# EasyEDA Pro project ProProject_powerboard_ssl_philipp_2023-09-25.epro, schematic Schematic3
Create Date: 2023-04-07; Page Name: P1; Project Name: powerboard_ssl_philipp; Schematic Name: Schematic3; Update Date: 2023-04-07; Company: 嘉立创EDA; Page Size: A4; Version: V1.0
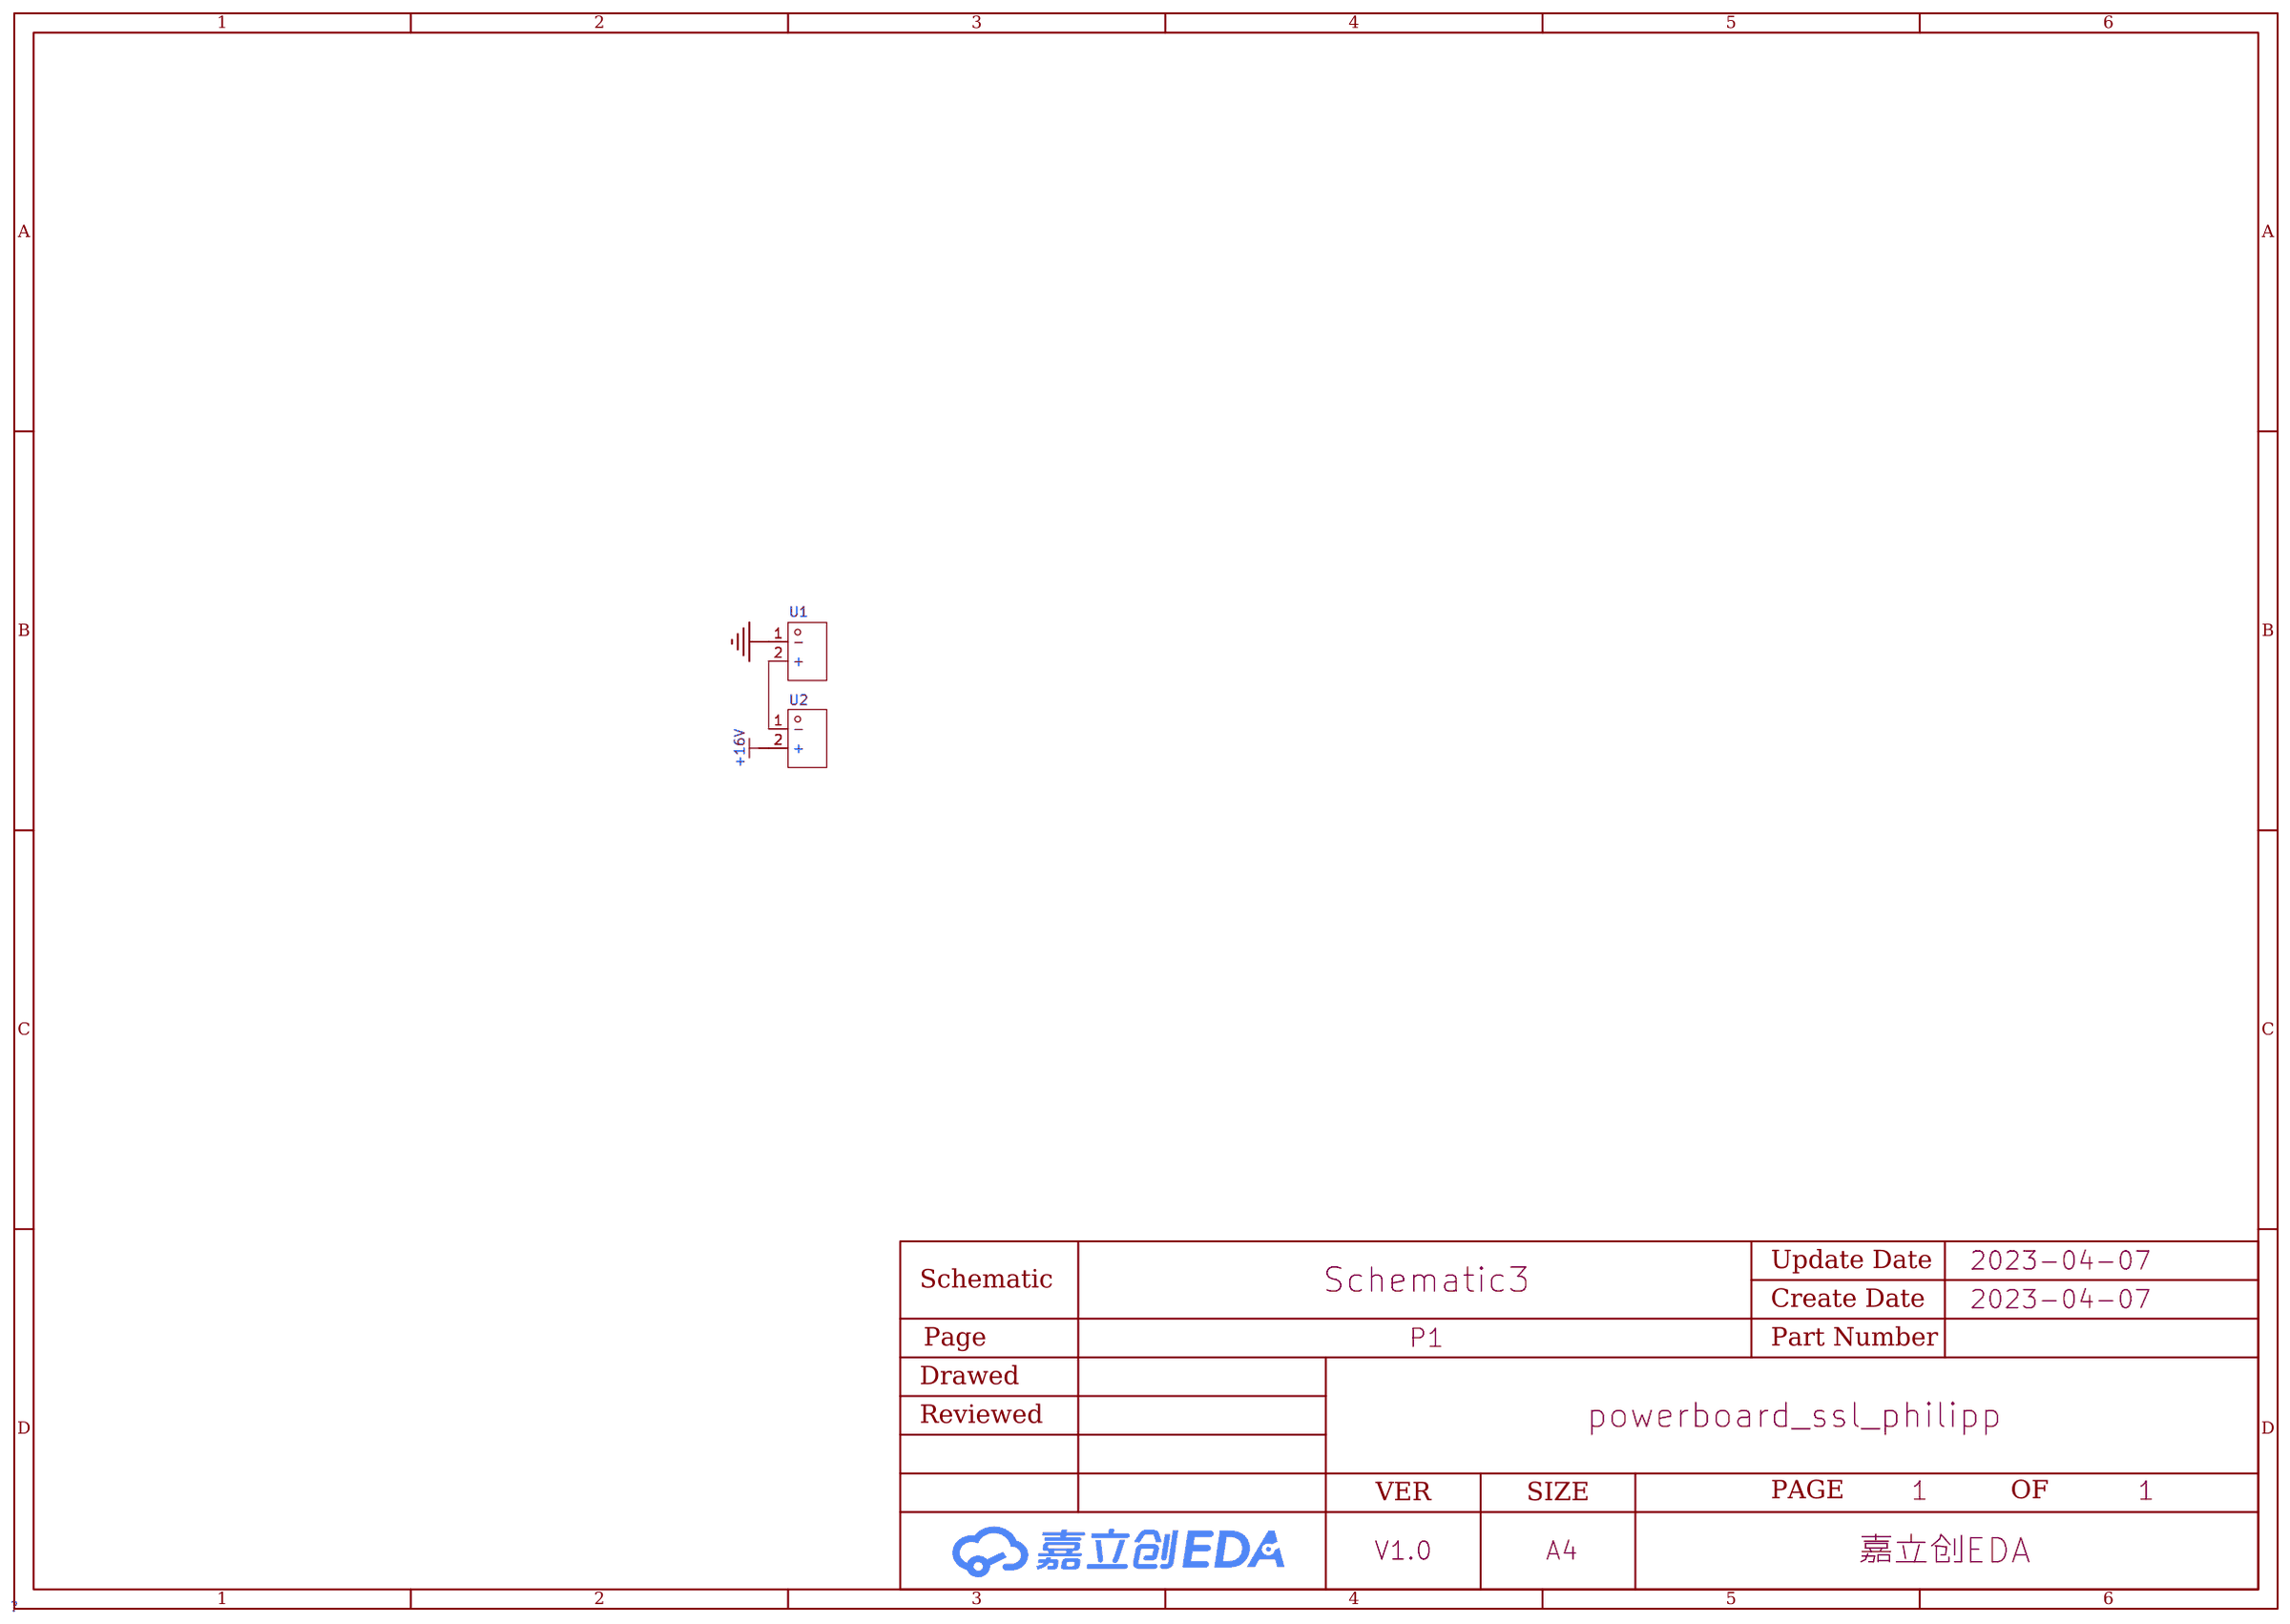
[diagram p13: schematic sheet]

## Parts
U1  XT60  [CONN-TH_XT60]
U2  XT60  [CONN-TH_XT60]

## Library data of the parts
U1 U2 = XT60: 模型锂电连接器 XT60-M; LCSC Part Name: XT60公头（电调端）; Supplier Part: C98733; Manufacturer: AMASS(艾迈斯); JLCPCB Part Class: Extended Part; Datasheet: https://atta.szlcsc.com/upload/public/pdf/source/20170606/1496716524919.pdf; Supplier: LCSC

## Nets
+16V: U2.2(+)
GND: U1.1(-)
$1N211: U1.2(+) U2.1(-)
